# EAGLE design Receiver Schematic (EAGLE 8.3.0)
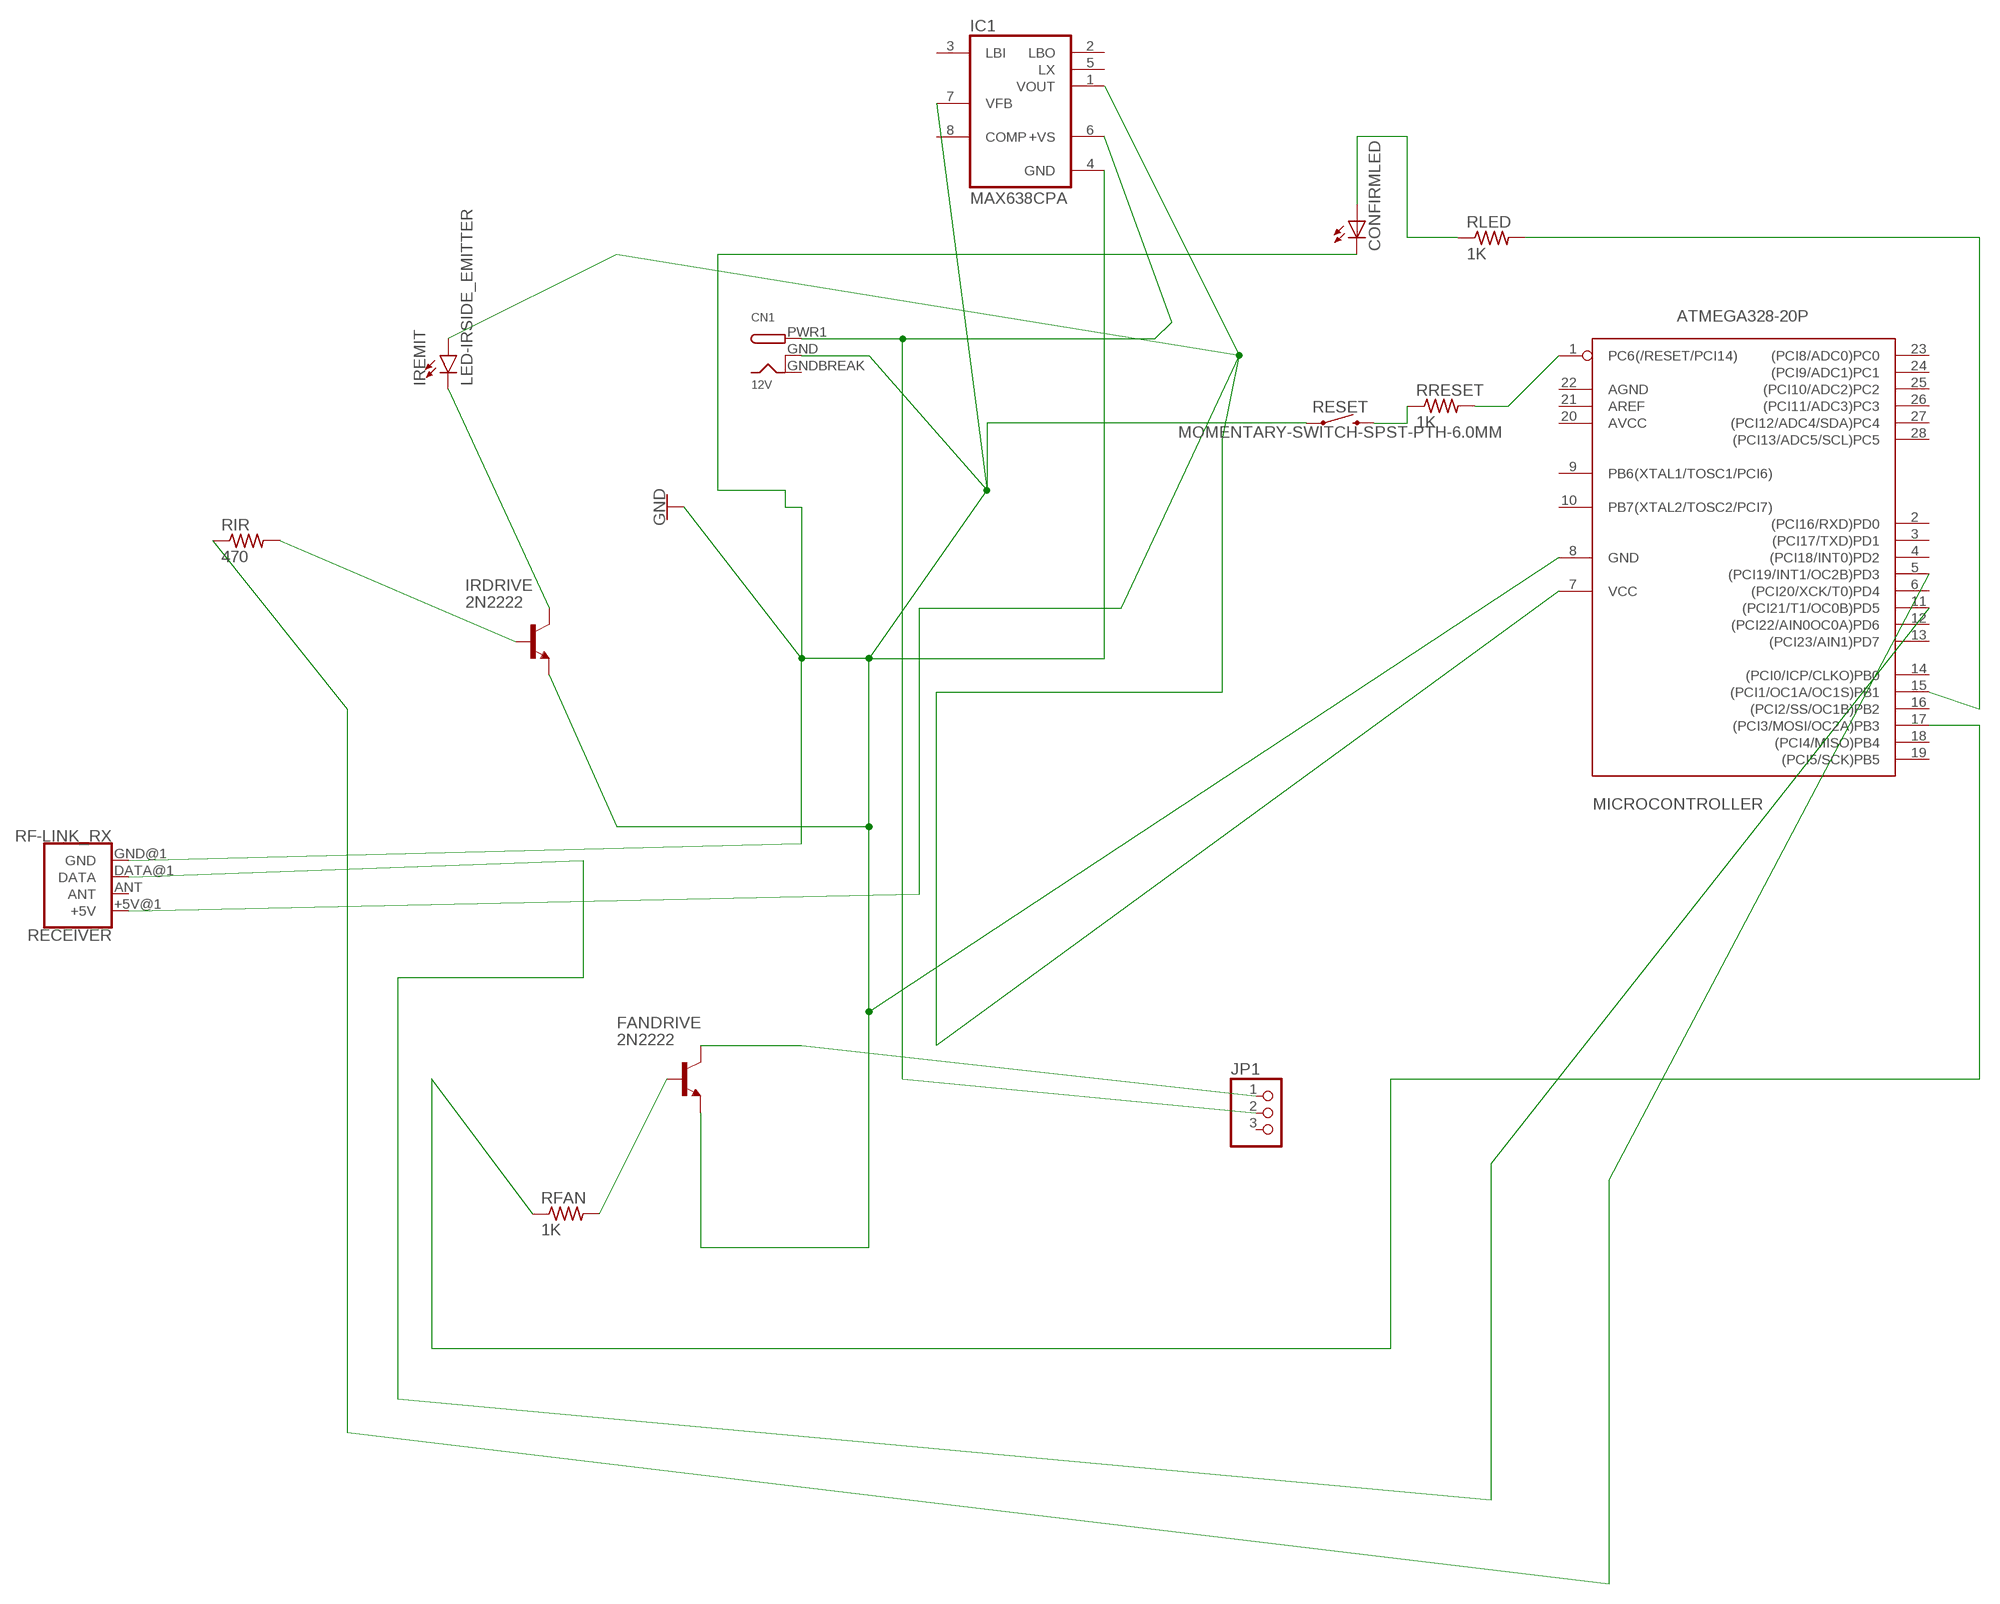
[diagram p0: schematic, sheet 1]

## Parts
CN1  12V  DCBARRELSMT  [DCJACK_2MM_SMT]
CONFIRMLED  LEDCHIP-LED0805  [CHIP-LED0805]
FANDRIVE  2N2222  [TO92-EBC-OVAL]
IC1  MAX638CPA  [DIL08]
IRDRIVE  2N2222  [TO92-EBC-OVAL]
IREMIT  LED-IRSIDE_EMITTER  [LTE-302]
JP1  PINHD-1X3  [1X03]
MICROCONTROLLER  ATMEGA328-20P  [DIL28-3]
RECEIVER  RF-LINK_RX  [RF-LINK_RX]
RESET  MOMENTARY-SWITCH-SPST-PTH-6.0MM  [TACTILE_SWITCH_PTH_6.0MM]
RFAN  1K  R-US_R0805  [R0805]
RIR  470  R-US_R0805  [R0805]
RLED  1K  R-US_R0805  [R0805]
RRESET  1K  R-US_R0805  [R0805]

## Nets
GND: CN1.GND(GNDBREAK) CONFIRMLED.C FANDRIVE.E IC1.4(GND) IC1.7(VFB) IRDRIVE.E MICROCONTROLLER.8(GND) RECEIVER.GND@1(GND) RESET.1
N$1: IRDRIVE.C IREMIT.C
N$2: CN1.PWR1(PWR) IC1.6(+VS) JP1.2
N$3: MICROCONTROLLER.17((PCI3/MOSI/OC2A)PB3) RFAN.1
N$4: IC1.1(VOUT) IREMIT.A MICROCONTROLLER.7(VCC) RECEIVER.+5V@1(+5V)
N$5: FANDRIVE.C JP1.1
N$6: IRDRIVE.B RIR.2
N$7: FANDRIVE.B RFAN.2
N$8: MICROCONTROLLER.15((PCI1/OC1A/OC1S)PB1) RLED.2
N$9: MICROCONTROLLER.5((PCI19/INT1/OC2B)PD3) RIR.1
N$10: MICROCONTROLLER.11((PCI21/T1/OC0B)PD5) RECEIVER.DATA@1(DATA)
N$11: CONFIRMLED.A RLED.1
N$12: RESET.3 RRESET.1
N$13: MICROCONTROLLER.1(PC6(/RESET/PCI14)) RRESET.2
Unconnected: IC1.2(LBO) IC1.3(LBI) IC1.5(LX) IC1.8(COMP) JP1.3 MICROCONTROLLER.2((PCI16/RXD)PD0) MICROCONTROLLER.3((PCI17/TXD)PD1) MICROCONTROLLER.4((PCI18/INT0)PD2) MICROCONTROLLER.6((PCI20/XCK/T0)PD4) MICROCONTROLLER.9(PB6(XTAL1/TOSC1/PCI6)) MICROCONTROLLER.10(PB7(XTAL2/TOSC2/PCI7)) MICROCONTROLLER.12((PCI22/AIN0OC0A)PD6) MICROCONTROLLER.13((PCI23/AIN1)PD7) MICROCONTROLLER.14((PCI0/ICP/CLKO)PB0) MICROCONTROLLER.16((PCI2/SS/OC1B)PB2) MICROCONTROLLER.18((PCI4/MISO)PB4) MICROCONTROLLER.19((PCI5/SCK)PB5) MICROCONTROLLER.20(AVCC) MICROCONTROLLER.21(AREF) MICROCONTROLLER.22(AGND) MICROCONTROLLER.23((PCI8/ADC0)PC0) MICROCONTROLLER.24((PCI9/ADC1)PC1) MICROCONTROLLER.25((PCI10/ADC2)PC2) MICROCONTROLLER.26((PCI11/ADC3)PC3) MICROCONTROLLER.27((PCI12/ADC4/SDA)PC4) MICROCONTROLLER.28((PCI13/ADC5/SCL)PC5) RECEIVER.ANT

## Power pins joined to a net without a drawn wire
GND: CN1.GNDBREAK(GND)

## Library data of the parts
CN1 = adafruit:DCBARREL: 2.0mm DC Barrel Jack DCJACK_2MM_PTH - Through Hole Jack (4UConnector: 05537)
CONFIRMLED = adafruit:LED: LED OSRAM: - CHIPLED LG R971, LG N971, LY N971, LG Q971, LY Q971, LO R971, LY R971 LH N974, LH R974 LS Q976, LO Q976, LY Q976 LO Q996 - Hyper CHIPLED LW Q18S LB Q993, LB Q99A, LB R99A - SideLED LS A670, LO A670, LY A670, LG A670, LP A670 LB A673, LV A673, LT A673, LW A673 LH A674 LY A675 LS A676, LA A676, LO A676, LY A676, LW A676 LS A679, LY A679, LG A679 - Hyper Micro SIDELED® LS Y876, LA Y876, LO Y876, LY Y876 LT Y87S - SmartLED LW L88C, LW L88S LB L89C, LB L89S, LG L890 LS L89K, LO L89K, LY L89K LS L896, LA L896, LO L896, LY L896 - TOPLED LS T670, LO T670, LY T670, LG T670, LP T670 LSG T670, LSP T670, LSY T670, LOP T670, LYG T670 LG T671, LOG T671, LSG T671 LB T673, LV T673, LT T673, LW T673 LH T674 LS T676, LA T676, LO T676, LY T676, LB T676, LH T676, LSB T676, LW T676 LB T67C, LV T67C, LT T67C, LS T67K, LO T67K, LY T67K, LW E67C LS E67B, LA E67B, LO E67B, LY E67B, LB E67C, LV E67C, LT E67C LW T67C LS T679, LY T679, LG T679 LS T770, LO T770, LY T770, LG T770, LP T770 LB T773, LV T773, LT T773, LW T773 LH T774 LS E675, LA E675, LY E675, LS T675 LS T776, LA T776, LO T776, LY T776, LB T776 LHGB T686 LT T68C, LB T68C - Hyper Mini TOPLED® LB M676 - Mini TOPLED Santana® LG M470 LS M47K, LO M47K, LY M47K Source: http://www.osram.convergy.de/
FANDRIVE IRDRIVE = adafruit:2N2222: NPN TRANSISTOR Big oval pads
IC1 = maxim:MAX638CPA: Step-down SWITCHING REGULATOR; OC_FARNELL: unknown; OC_NEWARK: unknown
IREMIT = SparkFun-LED:LED-IR: Infrared LED (IR) Wavelength: 940nm Packages: TSAL6100 LTE302 - Side firing. Check SparkFun-Sensors.lbr for the receiver SparkFun Products: ZX Distance and Gesture Sensor <[https://www.sparkfun.com/products/12780]> Infrared Emitters and Detectors <https://www.sparkfun.com/products/241>; PROD_ID: DIO-10904; SF_ID: SEN-00241
JP1 = adafruit:PINHD-1X3: PIN HEADER
MICROCONTROLLER = atmega328:ATMEGA328*P: MICROCONTROLLER 32 kBytes FLASH 2 kBytes SRAM 1 kBytes EEPROM USART 8-channel 10 bit ADC
RECEIVER = SparkFun-RF:RF-LINK_RX: RF Link Receiver (434 MHz, 315 MHz) These wireless receivers work with equivalent transmitters. They can easily fit into a breadboard and work well with microcontrollers to create a very simple wireless data link. Since these are only receivers, they will only work communicating data one-way, you would need two pairs (of different frequencies) to act as a transmitter/receiver pair.. SparkFun Products RF Link Receiver - 4800bps (434 MHz) <https://www.sparkfun.com/products/10532>(WRL-10532); SF_ID: WRL-10533
RESET = SparkFun-Switches:MOMENTARY-SWITCH-SPST: Momentary Switch (Pushbutton) - SPST Normally-open (NO) SPST momentary switches (buttons, pushbuttons). Variants PTH-12MM - 12mm square, through-hole Momentary Pushbutton Switch - 12mm Square <https://www.sparkfun.com/products/9190> (COM-09190) PTH-6.0MM, PTH-6.0MM-KIT - 6.0mm square, through-hole Mini Pushbutton Switch <https://www.sparkfun.com/products/97> (COM-00097) KIT package intended for soldering kit's - only one side of pads' copper is exposed. PTH-RIGHT-ANGLE-KIT - Right-angle, through-hole Right Angle Tactile Button <https://www.sparkfun.com/products/10791> - Used on SparkFun BigTime Watch Kit <https://www.sparkfun.com/products/11734> SMD-12MM - 12mm square, surface-mount Tactile Button - SMD (12mm) <https://www.sparkfun.com/products/12993> (COM-12993) Used on SparkFun PicoBoard <https://www.sparkfun.com/products/11888> SMD-4.5MM - 4.5mm Square Trackball Switch Used on SparkFun Blackberry Trackballer Breakout <https://www.sparkfun.com/products/13169> SMD-4.6MMX2.8MM - 4.60mm x 2.80mm, surface mount Used on SparkFun SAMD21 Mini Breakout <https://www.sparkfun.com/products/13664> SMD-5.2MM, SMD-5.2-REDUNDANT - 5.2mm square, surface-mount Mini Pushbutton Switch - SMD <https://www.sparkfun.com/products/8720> (COM-08720) Used on Arduino Pro Mini <https://www.sparkfun.com/products/11114> REDUNDANT package connects both switch circuits together SMD-6.0X3.5MM - 6.0 x 3.5mm, surface mount Momentary Reset Switch SMD <https://www.sparkfun.com/products/8229> (COM-08229) SMD-6.2MM-TALL - 6.2mm square, surface mount Tactile Button - SMD (6mm) <https://www.sparkfun.com/products/12992> Used on SparkFun Digital Sandbox <https://www.sparkfun.com/products/12651> SMD-RIGHT-ANGLE - Right-angle, surface mount Used on SparkFun Block for Intel® Edison - Arduino <https://www.sparkfun.com/products/13036>; PROD_ID: SWCH-08441; SF_SKU: COM-00097
RFAN RIR RLED RRESET = adafruit:R-US_: RESISTOR, American symbol

## Board
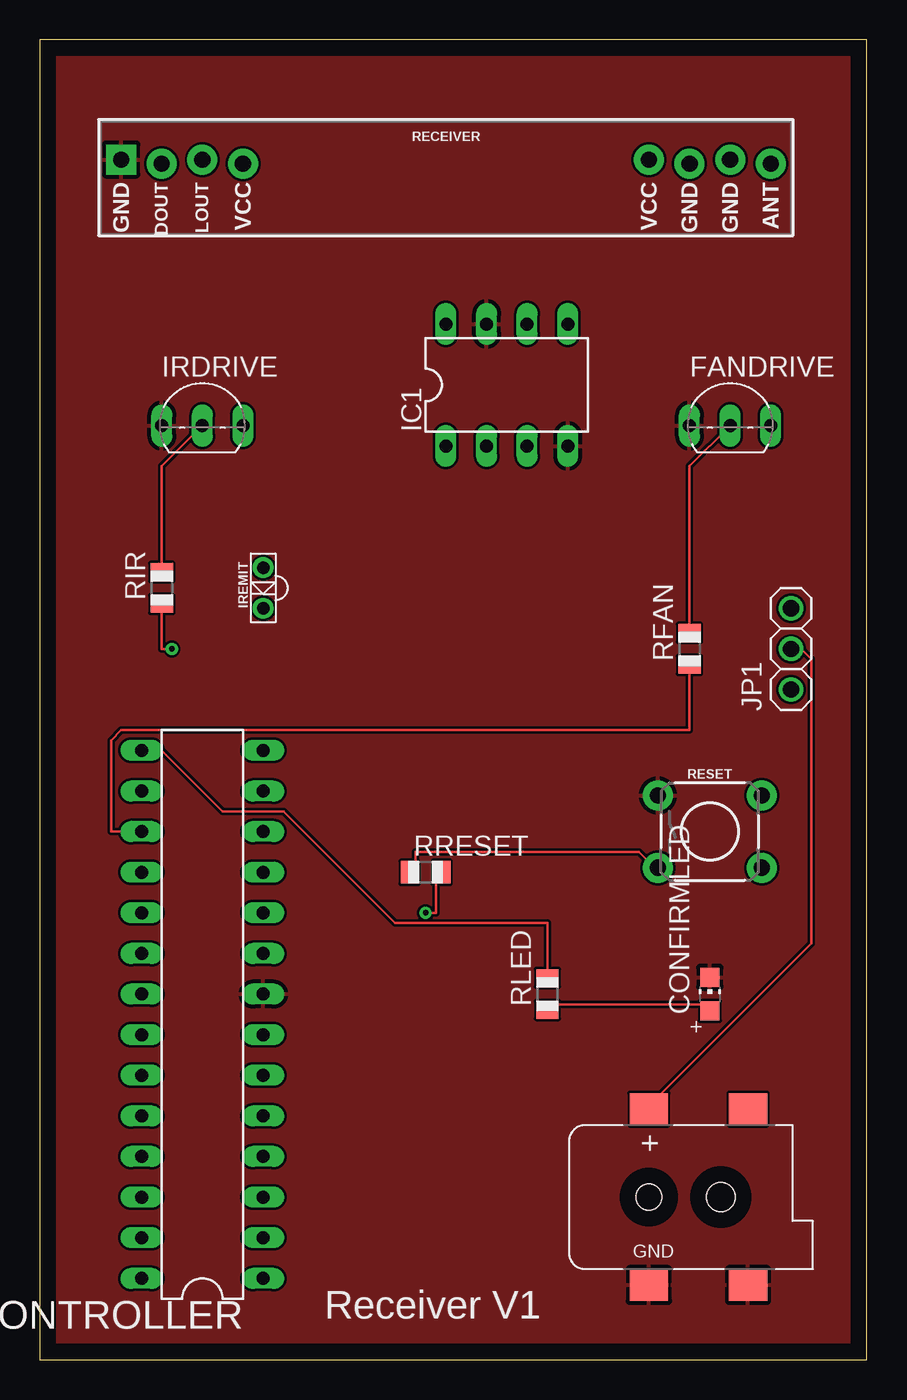
[diagram p1: board, top side]
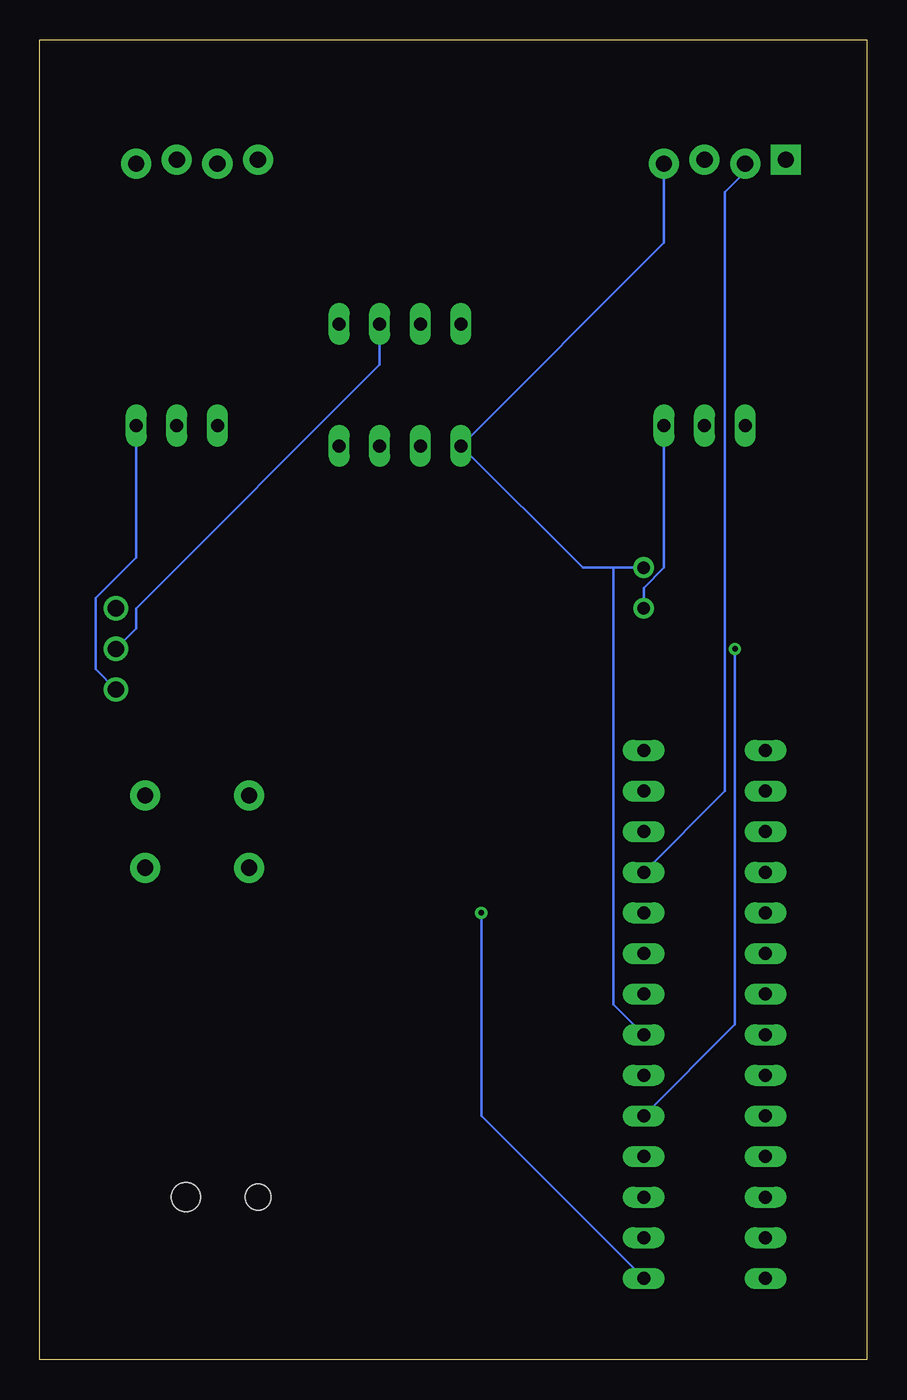
[diagram p2: board, bottom side, seen from below]

Size 51.74 x 82.54 mm. Coordinates in mm from the lower left corner, seen from the top.
Outline: 0,0 51.74,0 51.74,82.54 0,82.54 0,0
Copper layers (1*16): Top 0.035mm / dielectric 1.5mm / Bottom 0.035mm
Design rules "default": minimum track width 6mil, minimum drill 0.35mm, track to track 6mil, track to pad 6mil, pad to pad 6mil, via to via 6mil, smd to smd 6mil, copper to edge 40mil, drill to drill 6mil, minimum pad ring 10mil, minimum via ring 8mil, stop-mask expansion 4mil, vias tented up to drill 0mil, thermal gap 10mil

### Footprints (pad centres in the part's own frame; a part is rotated, then mirrored left to right if it is on the bottom)
DCJACK_2MM_SMT = smd 2.4 x 2: GND 0,-5.5; GNDBREAK 6.2,-5.5; PWR1 0,5.5; PWR2 6.2,5.5 | hole 1.6: 0,0 | hole 1.8: 4.5,0
CHIP-LED0805 = smd 1.2 x 1.2: A 0,-1.05; C 0,1.05
TO92-EBC-OVAL = drill 0.813 long: B 0,-1.27; C 2.54,-1.27; E -2.54,-1.27
DIL08 = drill 0.813 long: 1 -3.81,-3.81; 2 -1.27,-3.81; 3 1.27,-3.81; 4 3.81,-3.81; 5 3.81,3.81; 6 1.27,3.81; 7 -1.27,3.81; 8 -3.81,3.81
LTE-302 = drill 0.8: A 1.27,0; C -1.27,0
1X03 = drill 1.016: 1 -2.54,0; 2 0,0; 3 2.54,0
DIL28-3 = drill 0.813 long: 1 -16.51,-3.81; 2 -13.97,-3.81; 3 -11.43,-3.81; 4 -8.89,-3.81; 5 -6.35,-3.81; 6 -3.81,-3.81; 7 -1.27,-3.81; 8 1.27,-3.81; 9 3.81,-3.81; 10 6.35,-3.81; 11 8.89,-3.81; 12 11.43,-3.81; 13 13.97,-3.81; 14 16.51,-3.81; 15 16.51,3.81; 16 13.97,3.81; 17 11.43,3.81; 18 8.89,3.81; 19 6.35,3.81; 20 3.81,3.81; 21 1.27,3.81; 22 -1.27,3.81; 23 -3.81,3.81; 24 -6.35,3.81; 25 -8.89,3.81; 26 -11.43,3.81; 27 -13.97,3.81; 28 -16.51,3.81
RF-LINK_RX = drill 1.016 pad 1.88: +5V@1 -12.7,-0.127; +5V@2 12.7,0.127; ANT 20.32,-0.127; DATA@1 -17.78,-0.127; DATA@2 -15.24,0.127; GND@2 15.24,-0.127; GND@3 17.78,0.127 | drill 1.016 pad 1.88 square: GND@1 -20.32,0.127
TACTILE_SWITCH_PTH_6.0MM = drill 1.016 pad 1.88: 1 -3.251,2.261; 2 3.251,2.261; 3 -3.251,-2.261; 4 3.251,-2.261
R0805 = smd 1.1 x 1.4: 1 -1,0; 2 1,0

### Placement (x,y rotation side)
CN1  38.1,10.16 0 top
CONFIRMLED  41.91,22.86 0 top
FANDRIVE  43.18,59.69 0 top
IC1  29.21,60.96 0 top
IRDRIVE  10.16,59.69 0 top
IREMIT  13.97,48.26 90 top
JP1  46.99,44.45 90 top
MICROCONTROLLER  10.16,21.59 90 top
RECEIVER  25.4,74.93 0 top
RESET  41.91,33.02 0 top
RFAN  40.64,44.45 90 top
RIR  7.62,48.26 90 top
RLED  31.75,22.86 90 top
RRESET  24.13,30.48 0 top

### Tracks (layer width: path | path; a pad name or v marks a point on that pad's centre or on a via)
GND
  pour Top: 53.34,83.82 53.34,-1.27 -1.27,-1.27 -1.27,83.82
N$1
  Bottom 0.152: IREMIT.C 13.97,48.26 12.7,49.53 IRDRIVE.C
N$2
  Top 0.152: JP1.2 47.62,44.45 48.26,43.82 48.26,26.04 38.1,15.88 CN1.PWR1
  Bottom 0.152: IC1.6 30.48,62.23 45.72,46.99 45.72,45.72 JP1.2
N$3
  Top 0.152: RFAN.1 40.64,39.37 5.08,39.37 4.45,38.74 4.45,33.02 MICROCONTROLLER.17
N$4
  Bottom 0.152: 15.88,49.53 17.78,49.53 IC1.1 12.7,69.85 RECEIVER.+5V@1 | 15.88,49.53 IREMIT.A | MICROCONTROLLER.7 15.88,22.22 15.88,49.53
N$5
  Bottom 0.152: FANDRIVE.C 45.72,50.17 48.26,47.62 48.26,43.18 JP1.1
N$6
  Top 0.152: RIR.2 7.62,55.88 IRDRIVE.B
N$7
  Top 0.152: RFAN.2 40.64,55.88 FANDRIVE.B
N$8
  Top 0.152: RLED.2 31.75,27.3 22.22,27.3 15.24,34.29 11.43,34.29 7.62,38.1 MICROCONTROLLER.15
N$9  (via drill 0.35)
  Top 0.152: RIR.1 7.62,44.45 v8.25,44.45
  Bottom 0.152: v8.25,44.45 8.25,20.95 MICROCONTROLLER.5
N$10
  Bottom 0.152: MICROCONTROLLER.11 8.89,35.56 8.89,73.02 7.62,74.3 RECEIVER.DATA@1
N$11
  Top 0.152: CONFIRMLED.A 41.91,22.22 31.75,22.22 RLED.1
N$12
  Top 0.152: RRESET.1 23.5,30.48 23.5,31.75 37.47,31.75 38.1,31.11 RESET.3
N$13  (via drill 0.35)
  Top 0.152: v24.13,27.94 24.77,27.94 24.77,30.48 RRESET.2
  Bottom 0.152: v24.13,27.94 24.13,15.24 MICROCONTROLLER.1

### Text on the board
tNames: Receiver V1